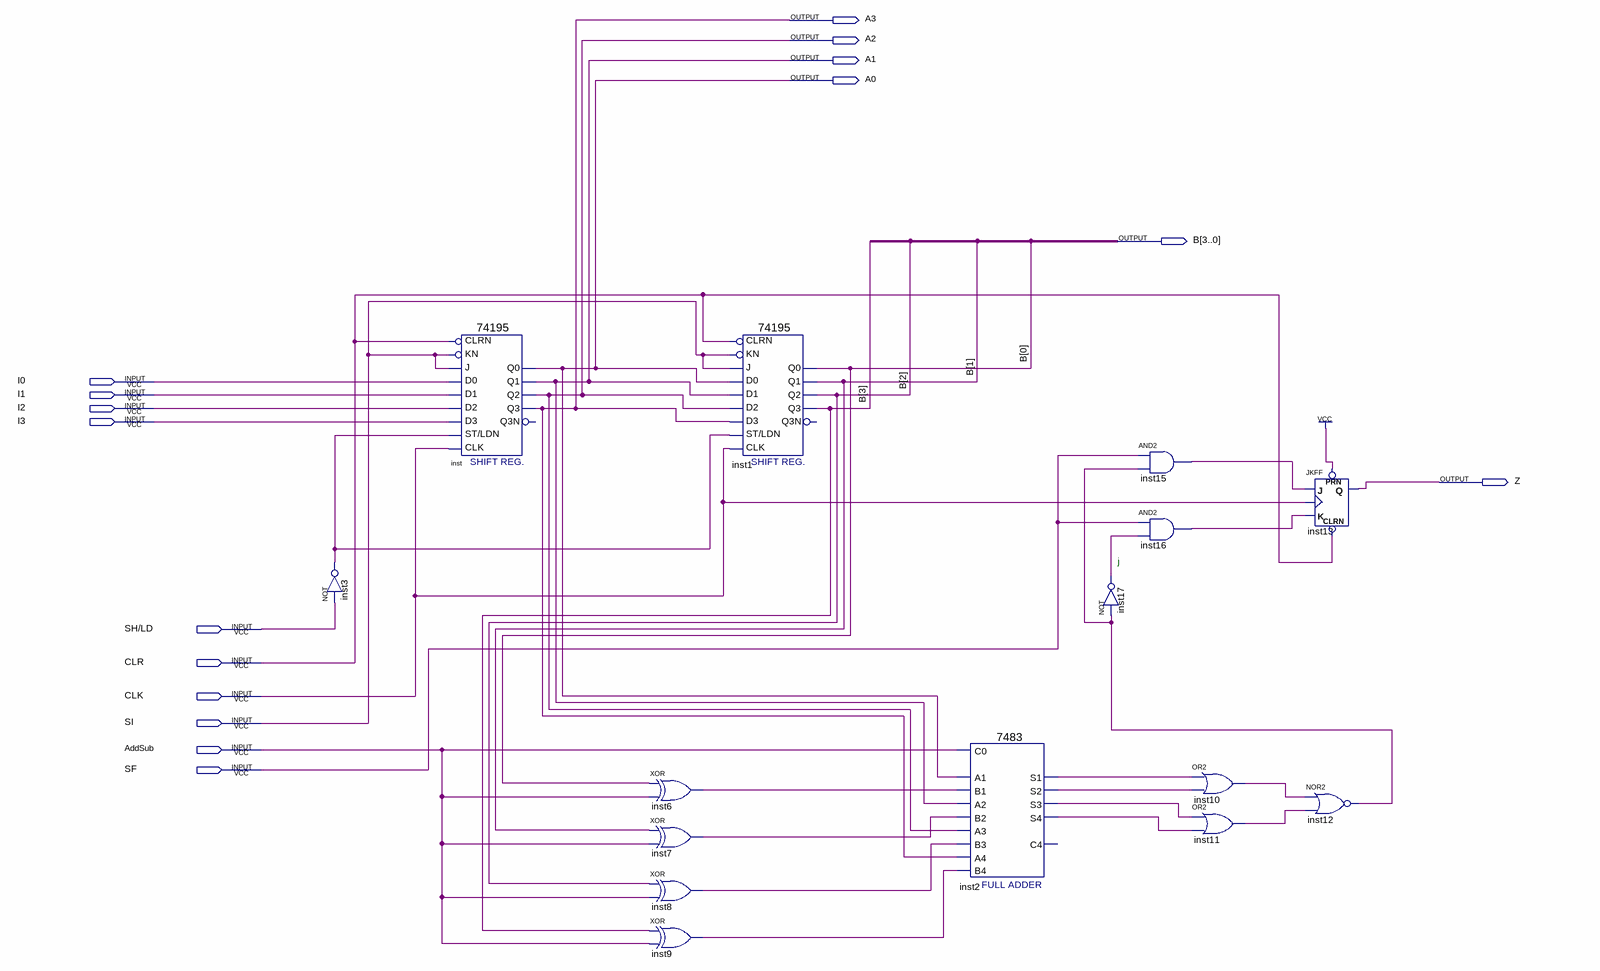
[diagram p0: schematic sheet]
// Quartus schematic DataPath.bdf as structural Verilog: 15 symbols, 16 pins
module DataPath (
  input  I0,
  input  I1,
  input  I2,
  input  I3,
  input  \SH/LD ,
  input  CLR,
  input  CLK,
  input  SI,
  input  AddSub,
  input  SF,
  output A3,
  output A2,
  output A1,
  output A0,
  output [3:0] B,
  output Z
);

  wire inst2_s1, inst2_s2, inst2_s3, inst2_s4, inst3_out, inst6_out, inst7_out, inst8_out, inst9_out,
       inst10_out, inst11_out, inst12_out, inst15_out, inst16_out, inst17_out;

  not inst3 (inst3_out, \SH/LD );
  \74195  inst (
    .\ST/LDN (inst3_out), .KN(SI), .CLRN(CLR), .D2(I2), .D1(I1), .D0(I0), .J(SI), .CLK(CLK), .D3(I3),
    .Q3(A3), .Q0(A0), .Q1(A1), .Q2(A2));  // open: Q3N
  xor inst6 (inst6_out, B[0], AddSub);
  xor inst7 (inst7_out, B[1], AddSub);
  xor inst8 (inst8_out, B[2], AddSub);
  xor inst9 (inst9_out, B[3], AddSub);
  \74195  inst1 (
    .\ST/LDN (inst3_out), .KN(SI), .CLRN(CLR), .D2(A2), .D1(A1), .D0(A0), .J(SI), .CLK(CLK), .D3(A3),
    .Q3(B[3]), .Q0(B[0]), .Q1(B[1]), .Q2(B[2]));  // open: Q3N
  \7483  inst2 (
    .B4(inst9_out), .C0(AddSub), .A1(A0), .A2(A1), .B1(inst6_out), .B2(inst7_out), .A3(A2), .B3(inst8_out),
    .A4(A3), .S3(inst2_s3), .S4(inst2_s4), .S2(inst2_s2), .S1(inst2_s1));  // open: C4
  not inst17 (inst17_out, inst12_out);
  and inst15 (inst15_out, SF, inst12_out);
  and inst16 (inst16_out, SF, inst17_out);
  or inst10 (inst10_out, inst2_s1, inst2_s2);
  or inst11 (inst11_out, inst2_s3, inst2_s4);
  JKFF inst13 (.PRN(1'b1), .CLRN(CLR), .K(inst16_out), .J(inst15_out), .CLK(CLK), .Q(Z));
  nor inst12 (inst12_out, inst10_out, inst11_out);

  // Notes on the sheet:
  //   j
endmodule
